# Altium project TK513_Limiter.PrjPcb
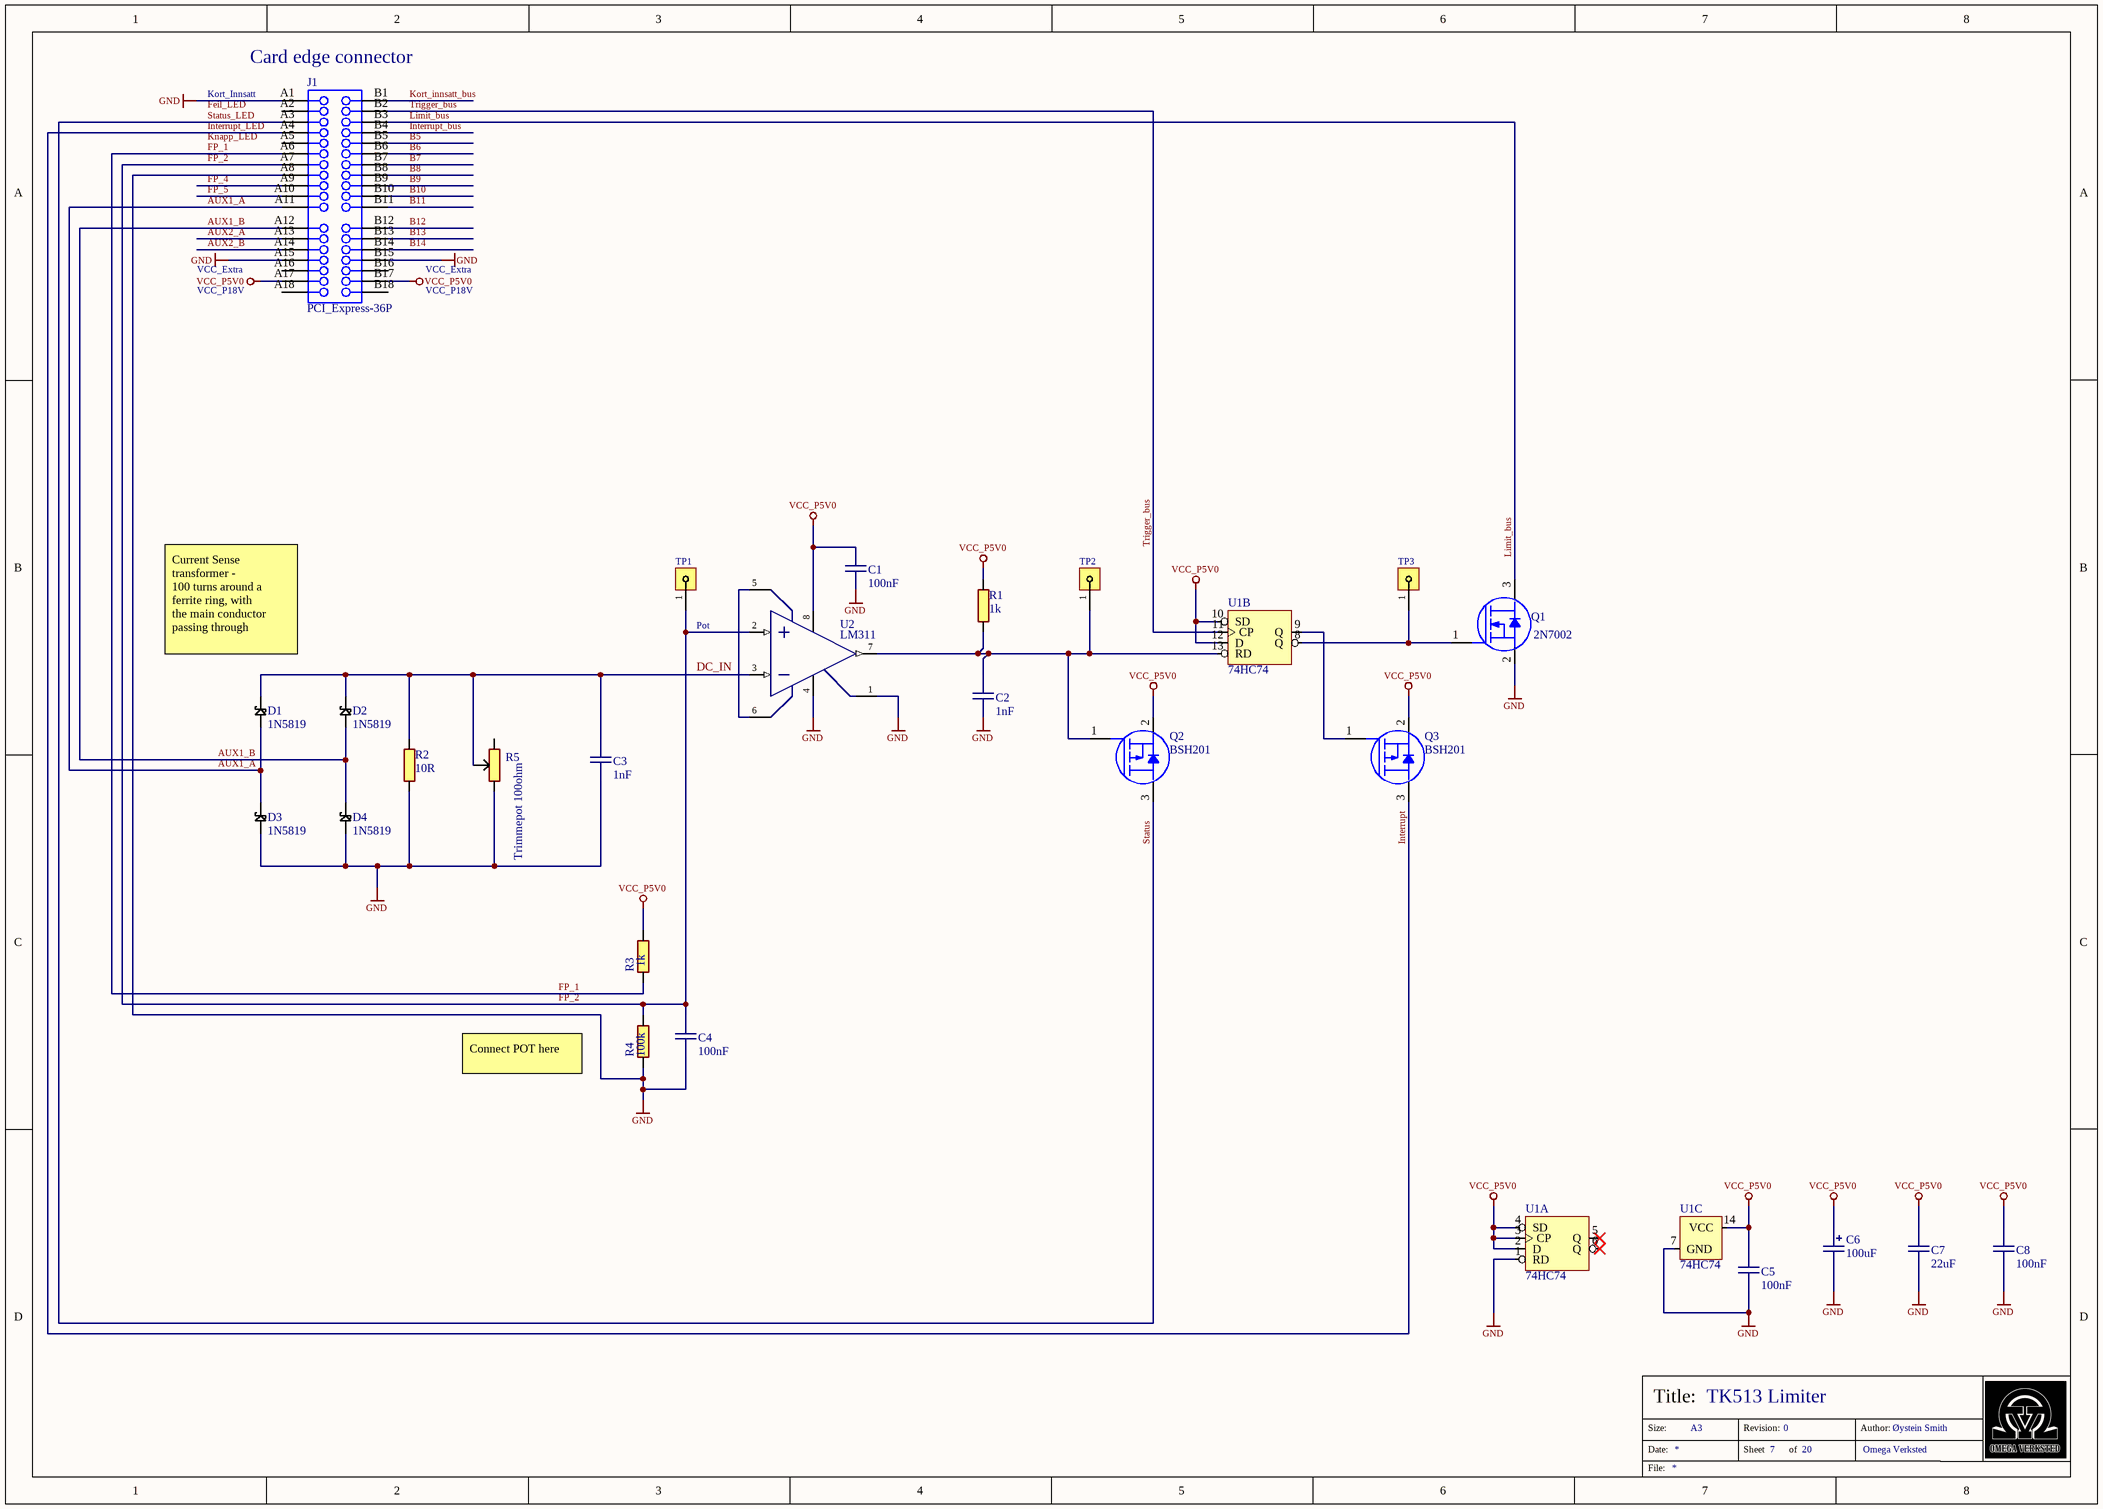
[diagram p0: TK513_Limiter.SchDoc]
1 sheet, 26 parts. Net scope: global (net labels, ports and power ports of the same name join across sheets).
Board file: TK513_Limiter.PcbDoc

## Sheet TK513_Limiter.SchDoc: TK513 Limiter
size A3; Author: Øystein Smith; Organization: Omega Verksted; DocumentNumber: 7; Revision: 0; SheetNumber: 7; SheetTotal: 20

### Parts
C1  100nF  [CAPC0603(1608)55_N]
C2  1nF  [CAPC0603(1608)55_N]
C3  1nF  [CAPC0603(1608)55_N]
C4  100nF  [CAPC0603(1608)55_N]
C5  100nF  [CAPC0603(1608)55_N]
C6  100uF  [CAPPR25D06H11]
C7  22uF  [CAPC1206(3216)170_N]
C8  100nF  [CAPC0603(1608)55_N]
D1  1N5819  [DO-41]
D2  1N5819  [DO-41]
D3  1N5819  [DO-41]
D4  1N5819  [DO-41]
J1  PCI_Express-36P  [PCIeX1-GF-2D-1000-1K-O36]
Q1  2N7002  [SOT323_N]
Q2  BSH201  [SOT23-3_N]
Q3  BSH201  [SOT23-3_N]
R1  1k  [RESC0603(1608)_N]
R2  10R  [RESC0603(1608)_N]
R3  1k  [RESC0603(1608)_N]
R4  100k  [RESC0603(1608)_N]
R5  Trimmepot 100ohm  [TRIMPOT_3006P]
TP1  Header1x1  [HDRV1W64P254_1X1_254X254X900B]  (value not drawn)
TP2  Header1x1  [HDRV1W64P254_1X1_254X254X900B]  (value not drawn)
TP3  Header1x1  [HDRV1W64P254_1X1_254X254X900B]  (value not drawn)
U1  74HC74  [SOIC-14]  (parts A,B,C of 3)
U2  LM311  [SOIC-8-WIDE]

### Nets
GND: C1.1 C2.1 C3.1 C4.1 C5.1 C6.1 C7.1 C8.1 D3.1(A) D4.1(A) J1.A1 J1.A8 J1.A15 J1.B15 Q1.2(Source) R2.2 R4.2 R5.1 U1.1(RD) U1.7(GND) U2.1(GND) U2.4(V-)
VCC_P5V0: C1.2 C5.2 C6.2 C7.2 C8.2 J1.A17 J1.B17 Q2.2(Source) Q3.2(Source) R1.1 R3.1 U1.2(D) U1.3(CP) U1.4(SD) U1.10(SD) U1.12(D) U1.14(VCC) U2.8(V+)
AUX1_A: D1.1(A) D3.2(K) J1.A11
AUX1_B: D2.1(A) D4.2(K) J1.A12
AUX2_A: J1.A13
AUX2_B: J1.A14
B5: J1.B5
B6: J1.B6
B7: J1.B7
B8: J1.B8
B9: J1.B9
B10: J1.B10
B11: J1.B11
B12: J1.B12
B13: J1.B13
B14: J1.B14
DC_IN: C3.2 D1.2(K) D2.2(K) R2.1 R5.2 U2.3(IN-)
FP_1: J1.A6 R3.2
FP_2: C4.2 J1.A7 R4.1 TP1.1 U2.2(IN+)
FP_4: J1.A9
FP_5: J1.A10
Interrupt: J1.A4 Q3.3(Drain)  [also labelled Interrupt_LED]
Interrupt_bus: J1.B4
Kort_innsatt_bus: J1.B1
Limit_bus: J1.B3 Q1.3(Drain)
Status: J1.A3 Q2.3(Drain)  [also labelled Status_LED]
Trigger_bus: J1.B2 U1.11(CP)
NetC2_2: C2.2 Q2.1(Gate) R1.2 TP2.1 U1.13(RD) U2.7(OUT)
NetQ1_1: Q1.1(Gate) TP3.1 U1.8(Q)
NetQ3_1: Q3.1(Gate) U1.9(Q)
NetU2_5: U2.5(BAL) U2.6(BAL/STB)

Not connected (* = marked no-connect by the designer): J1 A2 A5 A16 A18 B16 B18; R5 3; U1 5(Q)* 6(Q)*

### Notes on the sheet
- (near J1) Kort_Innsatt
- (near J1) Card edge connector
- VCC_Extra
- VCC_P18V
- Current Sense
  transformer -
  100 turns around a
  ferrite ring, with
  the main conductor
  passing through
- Pot
- Connect POT here
- Labels drawn without touching a wire or pin: Feil_LED, Knapp_LED
- Size:
- Date:
- Title:
- A3
- Revision:
- Sheet
- of
- Author:
- File:

### Library data of the parts
C1 C4 C5 C8 = 5152: X7R 50V 5%; id: 5152; pakke_opprettet_av: 815; leverandor_varenr: 1759122; pris: 1; nokkelord: Kondensator, Capacitor, CAP; produsent: Multicomp; leverandor: Farnell; pakketype: 0603; rad: 21; rom: OV; lager_type: Baklager; dybde: 0; antall: 1000; komponenttype: 2; pakke_opprettet: 18/02/2015 14:18:13; symbol_opprettet_av: 815; symbol_opprettet: 14/11/2014 20:19:34; navn: 100nF; hylle: 0
C2 C3 = 3687: X7R 50V 5%; id: 3687; pakke_opprettet_av: 815; pris: 1; nokkelord: Kondensator, Capacitor, CAP; produsent: Multicomp; leverandor: Farnell; pakketype: 0603; leverandor_varenr: 2310598; komponenttype: 2; pakke_opprettet: 18/02/2015 14:18:13; symbol_opprettet_av: 815; symbol_opprettet: 14/11/2014 20:19:34; navn: 1nF
C6 = 4858: 25V 2.5mm pitch; id: 4858; rad: 7; rom: OV; lager_type: Fremlager; dybde: 1; hylle: 4; antall: 38; pakke_opprettet_av: 815; leverandor_varenr: 1848439; pris: 2; nokkelord: Cap, Kondensator; produsent: Panasonic; leverandor: Farnell; pakketype: CAPPR; pakke_opprettet: 28/06/2014 17:35:52; symbol_opprettet_av: 815; symbol_opprettet: 28/06/2014 15:26:13; navn: 100uF; komponenttype: 2
C7 = 5192: 10V 10% Tantalum; id: 5192; pakke_opprettet_av: 815; leverandor_varenr: 1457420; pris: 3; nokkelord: Capacitor Cap Kondis; produsent: Kemet; leverandor: Farnell; pakketype: 1206; komponenttype: 2; pakke_opprettet: 11/02/2015 13:21:22; symbol_opprettet_av: 815; symbol_opprettet: 14/11/2014 20:19:34; navn: 22uF
D1-D4 = 5238: Schottkydiode, 1A, 40V; id: 5238; rad: 0; rom: OV; lager_type: Fremlager; hylle: 2; antall: 25; pakke_opprettet_av: 815; leverandor_varenr: 7429304; nokkelord: schottky, diode; produsent: Multicomp; leverandor: Farnell; pakketype: DO; komponenttype: 9; dybde: 0; pakke_opprettet: 28/06/2014 16:50:18; symbol_opprettet_av: 815; symbol_opprettet: 28/06/2014 15:20:09; navn: 1N5819; pris: 2
J1 = 3037: PCI express PCB kortkankonnektor; pakke_opprettet_av: 815; pris: 0; id: 3037; komponenttype: 11; produsent: PCB feature; navn: PCIeX1-GF-2D-1000-1K-O36; pakke_opprettet: 07/06/2015 17:49:10; symbol_opprettet_av: 815; symbol_opprettet: 06/07/2014 17:26:37; pakketype: -
Q1 = 3075: N-Channel MOSFET 300mA; id: 3075; rad: 2; rom: OV; lager_type: Fremlager; dybde: 0; hylle: 3; antall: 810; pakke_opprettet_av: 1165; symbol_opprettet_av: 774; leverandor_varenr: 1829184; pris: 1; leverandor: Farnell; pakketype: SOT-323; komponenttype: 4; produsent: Nexperia; pakke_opprettet: 12/05/2018 20:42:12; symbol_opprettet: 11/07/2014 23:17:04; navn: 2N7002
Q2 Q3 = 3085: P-Channel MOSFET 300mA; id: 3085; pakke_opprettet_av: 815; symbol_opprettet_av: 1150; leverandor_varenr: 1758073; pris: 3; produsent: NXP Semiconductors; leverandor: Farnell; pakketype: SOT; rom: OV; lager_type: Fremlager; dybde: 0; antall: 51; komponenttype: 4; Status: New; pakke_opprettet: 08/07/2014 20:37:25; symbol_opprettet: 14/09/2016 17:47:57; navn: BSH201; rad: 3; hylle: 3
R1 R3 = 5339: 0.1W 1% Thick film resistor; id: 5339; pakke_opprettet_av: 815; pris: 0; pakketype: 0603; leverandor_varenr: 2447272; nokkelord: Resistor Motstand; produsent: Multicomp; leverandor: Farnell; komponenttype: 1; pakke_opprettet: 08/07/2014 21:15:30; symbol_opprettet_av: 815; symbol_opprettet: 08/07/2014 21:16:33; navn: 1k
R2 = 5657: 0.1W 1% Thick film resistor; id: 5657; pakke_opprettet_av: 815; pris: 0; pakketype: 0603; rom: OV; lager_type: Baklager; hylle: 2; antall: 180; komponenttype: 1; leverandor: Farnell; leverandor_varenr: 2447233; produsent: Multicomp; pakke_opprettet: 08/07/2014 21:15:30; symbol_opprettet_av: 815; symbol_opprettet: 08/07/2014 21:16:33; navn: 10R; rad: 0; dybde: 0
R4 = 3778: 0.1W 1% Thick film resistor; id: 3778; rad: -1; rom: OV; lager_type: Fremlager; dybde: 96; hylle: 2; antall: 0; pakke_opprettet_av: 815; pakketype: 0603; komponenttype: 1; leverandor: Farnell; leverandor_varenr: 2447226; produsent: Multicomp; pakke_opprettet: 08/07/2014 21:15:30; symbol_opprettet_av: 815; symbol_opprettet: 08/07/2014 21:16:33; navn: 100k; pris: 0; nokkelord: Resistor
R5 = 3823: 15 turn, horizontal; id: 3823; rad: 1; rom: OV; lager_type: Fremlager; dybde: 0; hylle: 3; antall: 54; pakke_opprettet_av: 815; leverandor_varenr: 9352279; pris: 15; nokkelord: trimpot; produsent: Bourns; leverandor: Farnell; pakketype: TH; pakke_opprettet: 10/02/2017 15:29:47; symbol_opprettet_av: 815; symbol_opprettet: 03/11/2016 15:34:07; navn: Trimmepot 100ohm; komponenttype: 1
TP1-TP3 = 5093: 2,54mm pitch; id: 5093; pakke_opprettet_av: 815; pris: 1; pakketype: TH; komponenttype: 11; pakke_opprettet: 13/11/2014 12:30:32; symbol_opprettet_av: 815; symbol_opprettet: 13/11/2014 10:58:46; navn: Header 1x1
U1 = 3211: Dual D flip flop; id: 3211; pakke_opprettet_av: 815; leverandor_varenr: 9591680; pris: 4; nokkelord: Logikk; produsent: Texas Instruments; leverandor: Farnell; pakketype: SOIC; komponenttype: 8; pakke_opprettet: 28/06/2014 18:13:44; symbol_opprettet_av: 815; symbol_opprettet: 28/06/2014 15:25:05; navn: 74HC74
U2 = 3241: Comparator, High Speed; id: 3241; pakke_opprettet_av: 815; leverandor_varenr: 2293183; pris: 2; produsent: Texas Instruments; leverandor: Farnell; pakketype: SOIC; pakke_opprettet: 28/06/2014 18:39:37; symbol_opprettet_av: 815; symbol_opprettet: 16/01/2017 15:59:36; navn: LM311

## Assembly variants
Default assembly: not fitted Q2